# EasyEDA Pro project car1.eprj, schematic Schematic11
Board Name: V2.0-驱动板; Create Date: 2025-06-19; Page Name: P1; Project Name: car1; Schematic Name: Schematic11; Update Date: 2025-06-19; Company: 嘉立创EDA; Page Size: A4; Version: V1.0
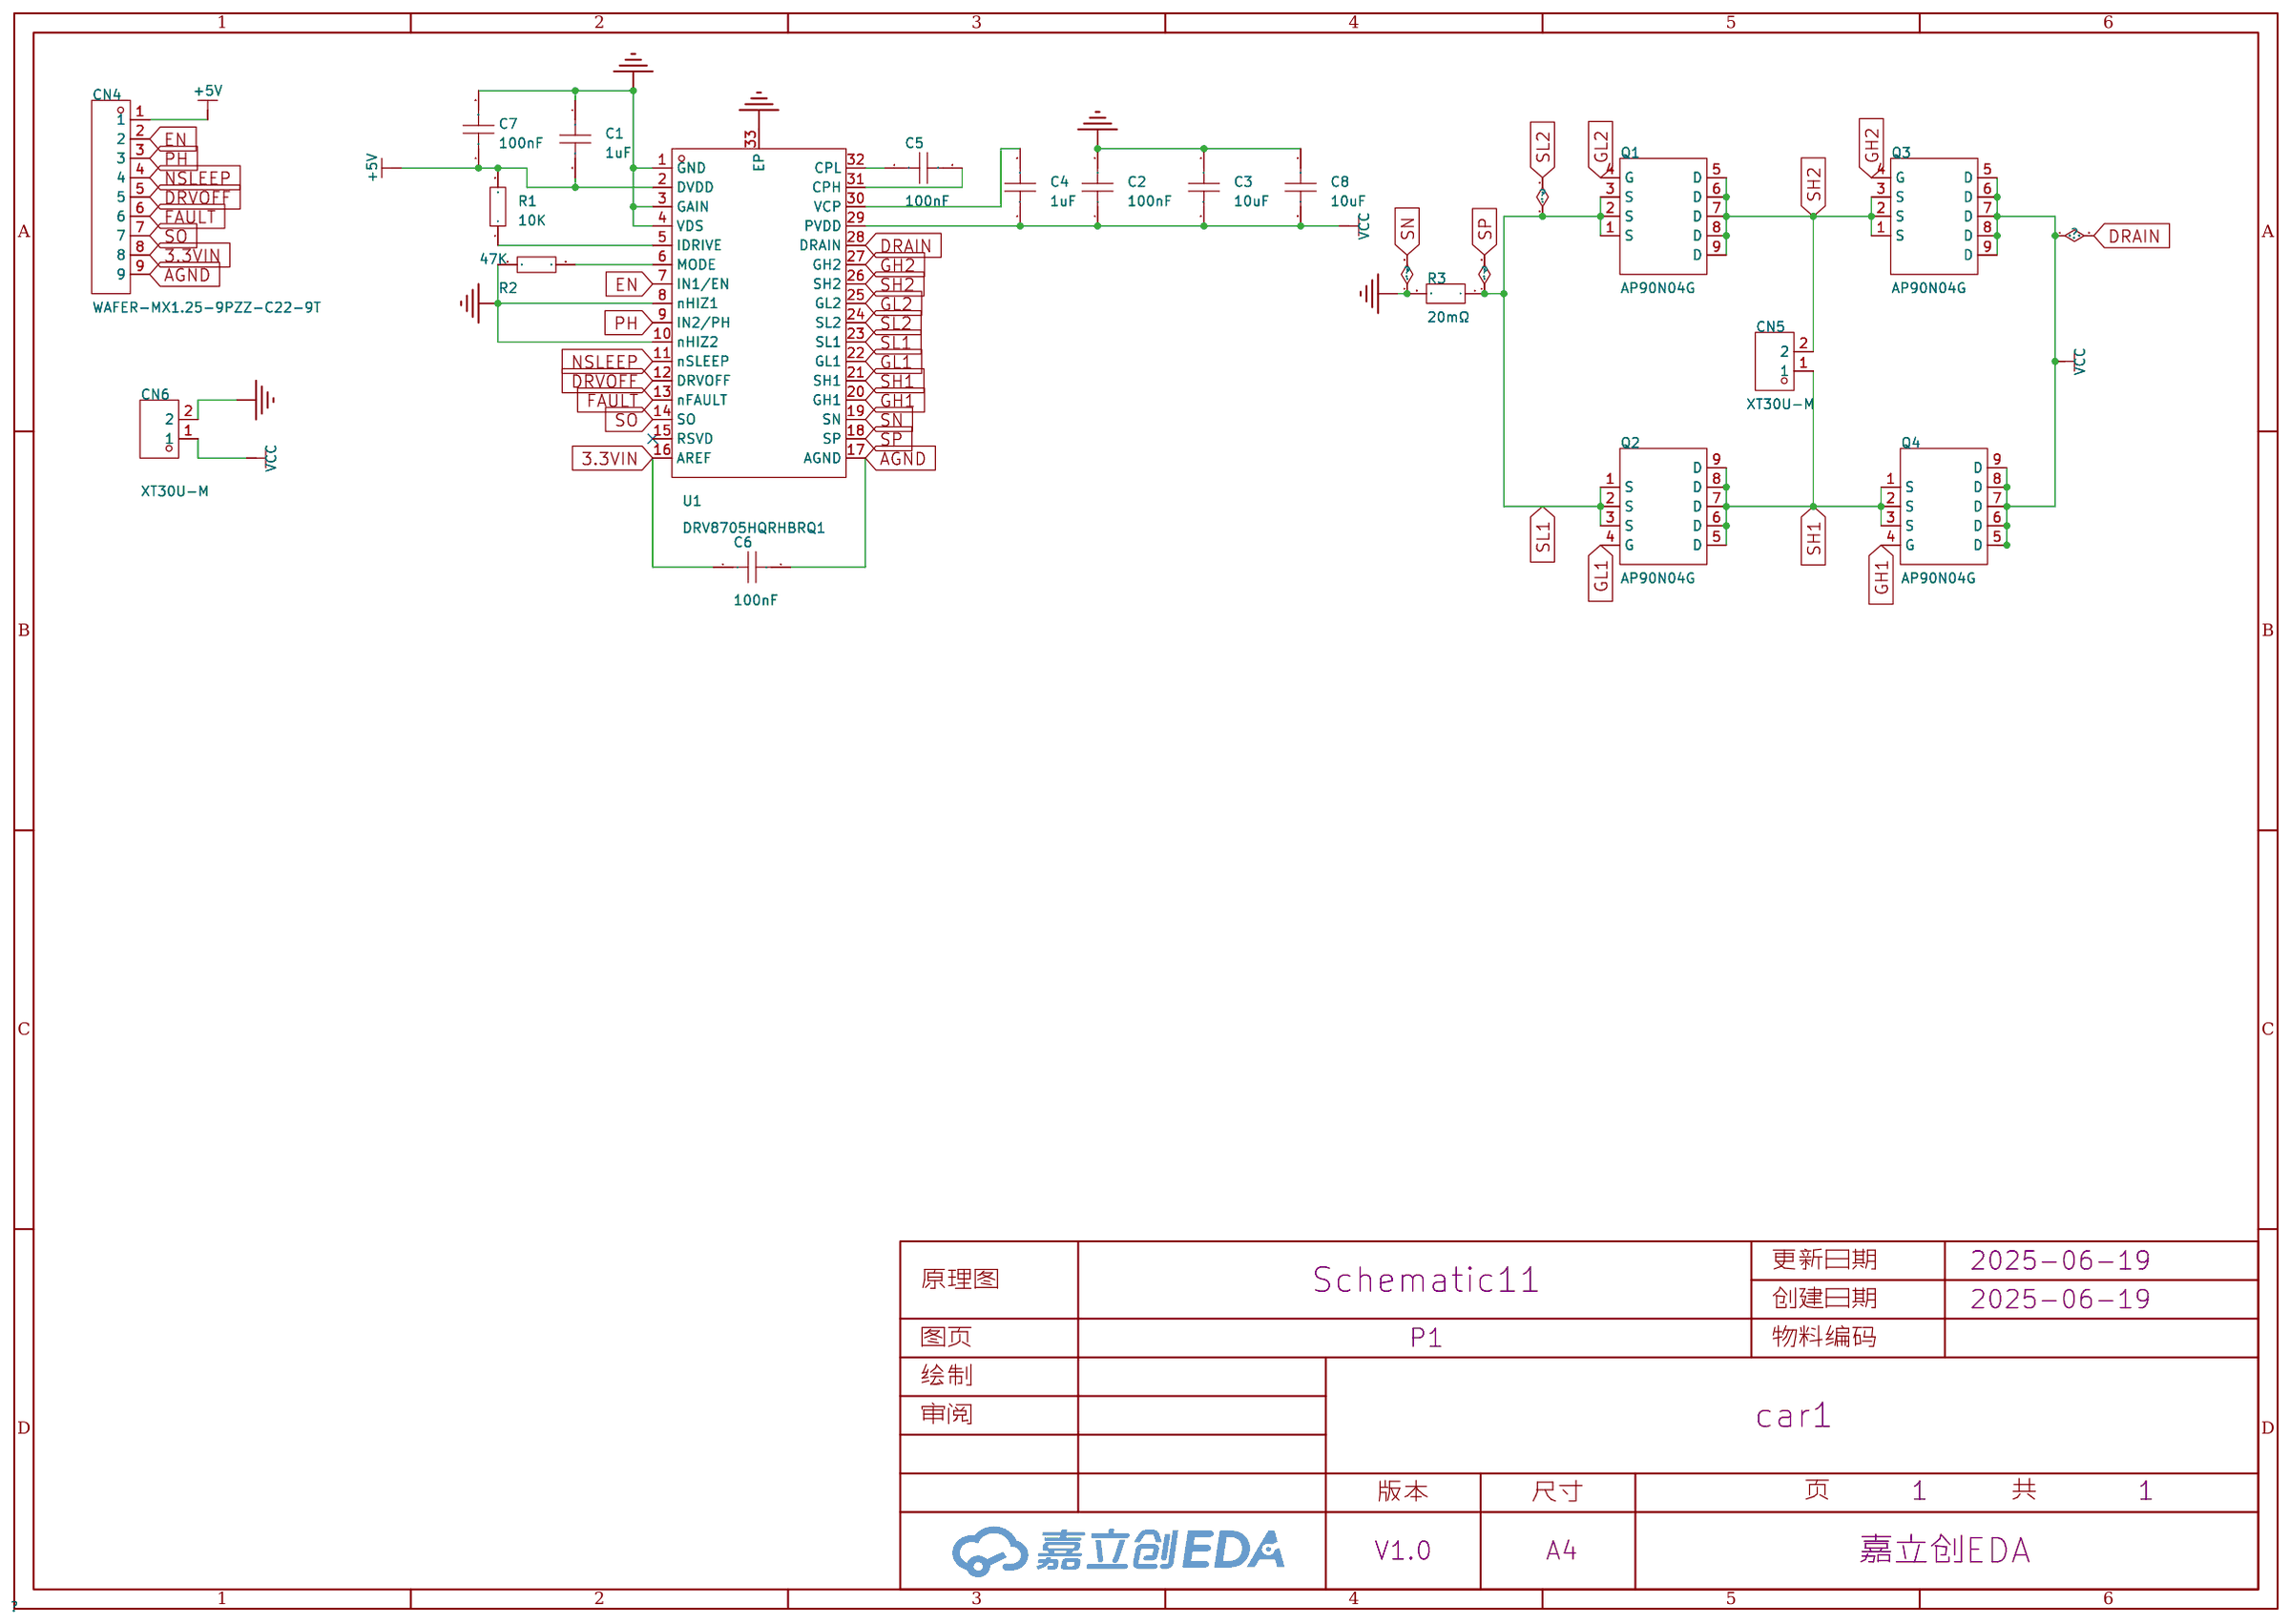
[diagram p0: schematic sheet]

## Parts
C1  1uF  [C0603]
C2  100nF  [C0603]
C3  10uF  [C1206]
C4  1uF  [C0603]
C5  100nF  [C0603]
C6  100nF  [C0603]
C7  100nF  [C0603]
C8  10uF  [C1206]
CN4  WAFER-MX1.25-9PZZ-C22-9T  [CONN-TH_WAFER-MX1.25-9PZZ-C22-9T]
CN5  XT30U-M  [CONN-TH_XT30U-M]
CN6  XT30U-M  [CONN-TH_XT30U-M]
Q1  AP90N04G  [PDFN-8_L5.8-W5.1-P1.27-LS6.1-BL]
Q2  AP90N04G  [PDFN-8_L5.8-W5.1-P1.27-LS6.1-BL]
Q3  AP90N04G  [PDFN-8_L5.8-W5.1-P1.27-LS6.1-BL]
Q4  AP90N04G  [PDFN-8_L5.8-W5.1-P1.27-LS6.1-BL]
R1  10K  [R0603]
R2  47K  [R0603]
R3  20mΩ  [R1206]
U1  DRV8705HQRHBRQ1  [VQFN-32_L5.0-W5.0-P0.50-TL-EP3.5]

## Library data of the parts
C1 C2 C4-C7 = CAP_0603: Supplier Footprint: 0603
C3 C8 = CAP_1206: Supplier Footprint: 1206
CN4 = WAFER-MX1.25-9PZZ-C22-9T: 插针结构:1x9P;间距:1.25mm;安装方式:直插;总PIN数:9P;排数:1;每排PIN数:9;额定电流:1A;触头材质:黄铜;触头镀层:锡;工作温度范围:-25℃~+85℃;; LCSC Part Name: 1x9P 间距:1.25mm 直插; Supplier Part: C32713119; Manufacturer: Yuandi(元迪); Supplier Footprint: P=1.25mm; JLCPCB Part Class: 扩展库; Datasheet: https://atta.szlcsc.com/upload/public/pdf/source/20240723/F18D3C457440615DA2D6F1C22EE09465.pdf; Supplier: LCSC; Pins Structure: 1x9P; Pitch: 1.25mm; Mounting Style: 直插; Number of Pins: 9P; Number of Rows: 1; Number of PINs Per Row: 9; Current Rating (Max): 1A; Contact Material: 黄铜; Contact Plating: 锡; Operating Temperature Range: -25℃~+85℃; Rated Voltage (Max): 125V; Plastic Material: PA9T
CN5 CN6 = XT30U-M: 类别:-;类型1:-;; LCSC Part Name: AMASS(艾迈斯)轻量版锂电池插头公头 XT30U-M; Supplier Part: C99101; Manufacturer: AMASS(艾迈斯); JLCPCB Part Class: 扩展库; Datasheet: https://atta.szlcsc.com/upload/public/pdf/source/20170606/1496716542582.pdf; Supplier: LCSC; Type: 插头; Colour: 黄色; InterfaceType: 公头
Q1-Q4 = AP90N04G: 类型:1个N沟道;漏源电压(Vdss):40V;连续漏极电流(Id):80A;导通电阻(RDS(on)@Vgs,Id):5.5mΩ@10V,30A;功率:77W;阈值电压(Vgs(th)@Id):2.5V@250uA;; LCSC Part Name: N沟道,电流:80A,耐压:40V; Supplier Part: C2995352; Manufacturer: ALLPOWER(铨力); Supplier Footprint: PDFN-8(5x6); JLCPCB Part Class: 扩展库; Datasheet: https://atta.szlcsc.com/upload/public/pdf/source/20220413/0CAD7DF91504A67728C8469556F37FCF.pdf; Supplier: LCSC; Type: 1个N沟道; Drain Source Voltage (Vdss): 40V; Continuous Drain Current (Id): 80A; Drain Source On Resistance (RDS(on)@Vgs,Id): 5.5mΩ@10V,30A; Power Dissipation (Pd): 77W; Gate Threshold Voltage (Vgs(th)@Id): 2.5V@250uA; Total Gate Charge (Qg@Vgs): 57nC; Input Capacitance (Ciss@Vds): 3.042nF@20V; Reverse Transfer Capacitance (Crss@Vds): 232pF@20V; Operating Temperature: -55℃~+175℃
R1 R2 = Res_0603: Supplier Footprint: 0603
R3 = JER1206F1R020: 电阻类型:采样电阻；合金电阻;阻值:20mΩ;精度:±1%;功率:1W;温度系数:±50ppm/℃;; LCSC Part Name: 20mΩ 1W 1206 ±1%; Supplier Part: C46634440; Manufacturer: 捷而瑞; Supplier Footprint: 1206; JLCPCB Part Class: 扩展库; Datasheet: https://atta.szlcsc.com/upload/public/pdf/source/20250318/D554CC95569B02A455FAE3D181D671EA.pdf; Supplier: LCSC; Type: 采样电阻；合金电阻; Tolerance: ±1%; Power(Watts): 1W; Temperature Coefficient: ±50ppm/℃
U1 = DRV8705HQRHBRQ1: DRV8705-Q1 具有离线诊断功能的汽车级、40V、H 桥智能栅极驱动器; Supplier Part: C2871884; Manufacturer: TI(德州仪器); Supplier Footprint: VQFN-32(5x5); JLCPCB Part Class: 扩展库; Datasheet: https://www.ti.com/cn/lit/gpn/drv8705-q1; Supplier: LCSC

## Nets
3.3VIN: C6.1 CN4.8 U1.16(AREF)
+5V: C1.2 C7.1 CN4.1 R1.2 U1.2(DVDD)
AGND: C6.2 CN4.9 U1.17(AGND)
GND: C1.1 C2.2 C3.1 C7.2 C8.1 CN6.2 R2.1 R3.2 U1.1(GND) U1.3(GAIN) U1.4(VDS) U1.8(nHIZ1) U1.10(nHIZ2) U1.19(SN) U1.33(EP)
VCC: C2.1 C3.2 C4.1 C8.2 CN6.1 Q3.5(D) Q3.6(D) Q3.7(D) Q3.8(D) Q3.9(D) Q4.5(D) Q4.6(D) Q4.7(D) Q4.8(D) Q4.9(D) U1.28(DRAIN) U1.29(PVDD)
DRVOFF: CN4.5 U1.12(DRVOFF)
EN: CN4.2 U1.7(IN1/EN)
FAULT: CN4.6 U1.13(nFAULT)
GH1: Q4.4(G) U1.20(GH1)
GH2: Q3.4(G) U1.27(GH2)
GL1: Q2.4(G) U1.22(GL1)
GL2: Q1.4(G) U1.25(GL2)
NSLEEP: CN4.4 U1.11(nSLEEP)
PH: CN4.3 U1.9(IN2/PH)
SH1: CN5.1 Q2.5(D) Q2.6(D) Q2.7(D) Q2.8(D) Q2.9(D) Q4.1(S) Q4.2(S) Q4.3(S) U1.21(SH1)
SH2: CN5.2 Q1.5(D) Q1.6(D) Q1.7(D) Q1.8(D) Q1.9(D) Q3.1(S) Q3.2(S) Q3.3(S) U1.26(SH2)
SL1: Q1.1(S) Q1.2(S) Q1.3(S) Q2.1(S) Q2.2(S) Q2.3(S) R3.1 U1.18(SP) U1.23(SL1) U1.24(SL2)
SO: CN4.7 U1.14(SO)
$1N490: R1.1 U1.5(IDRIVE)
$1N573: R2.2 U1.6(MODE)
$1N2720: C5.1 U1.32(CPL)
$1N2748: C5.2 U1.31(CPH)
$1N3615: C4.2 U1.30(VCP)

Not connected (* = marked no-connect by the designer): U1 15(RSVD)*
